# Altium project KC_Buffer.PrjPcb
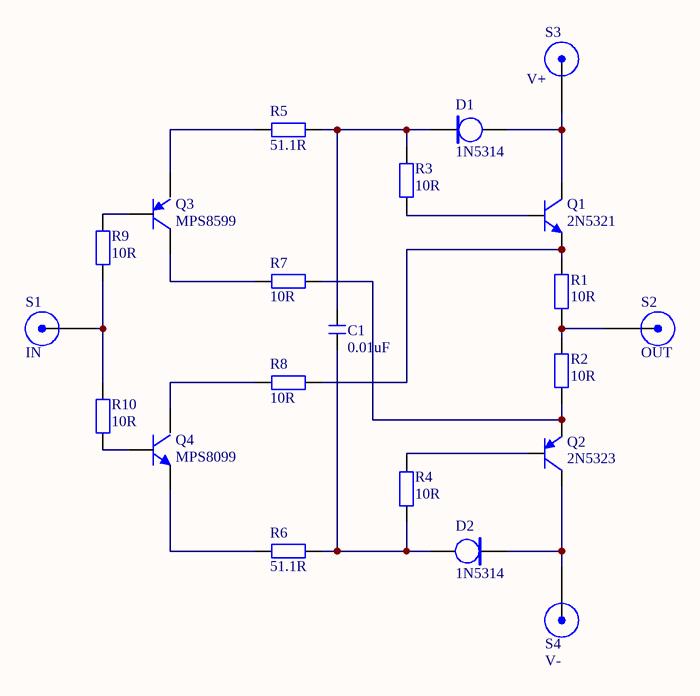
[diagram p0: KC_Buffer_Schematic.SchDoc]
1 sheet, 21 parts. Net scope: global (net labels, ports and power ports of the same name join across sheets).
Board file: KC_Buffer_PCB.PcbDoc

## Sheet KC_Buffer_Schematic.SchDoc
size A4

### Parts
C1  0.01uF  [CBB 6.3*6.3*5]
D1  1N5314  [DO-41G]
D2  1N5314  [DO-41G]
Q1  2N5321  [TO39_SMALLHOLE]
Q2  2N5323  [TO39_SMALLHOLE]
Q3  MPS8599  [TO92A_SmallHole]
Q4  MPS8099  [TO92A_SmallHole]
R1  10R  [RS 2W]
R2  10R  [RS 2W]
R3  10R  [RS 1/4W]
R4  10R  [RS 1/4W]
R5  51.1R  [RS 1/4W]
R6  51.1R  [RS 1/4W]
R7  10R  [RS 1/4W]
R8  10R  [RS 1/4W]
R9  10R  [RS 1/4W]
R10  10R  [RS 1/4W]
S1  IN  [Screw-M4-Small]
S2  OUT  [Screw-M4-Small]
S3  V+  [Screw-M4-Small]
S4  V-  [Screw-M4-Small]

### Nets
NetC1_1: C1.1 D2.2(Anode) R4.1 R6.1
NetC1_2: C1.2 D1.1(Cathode) R3.2 R5.1
NetD1_2: D1.2(Anode) Q1.2(C) S3.1(X)
NetD2_1: D2.1(Cathode) Q2.2(C) S4.1(X)
NetQ1_1: Q1.1(E) R1.2 R8.2
NetQ1_3: Q1.3(B) R3.1
NetQ2_1: Q2.1(E) R2.1 R7.2
NetQ2_3: Q2.3(B) R4.2
NetQ3_1: Q3.1(B) R9.2
NetQ3_2: Q3.2(C) R7.1
NetQ3_3: Q3.3(E) R5.2
NetQ4_1: Q4.1(B) R10.1
NetQ4_2: Q4.2(C) R8.1
NetQ4_3: Q4.3(E) R6.2
NetR1_1: R1.1 R2.2 S2.1(X)
NetR9_1: R9.1 R10.2 S1.1(X)

### Library data of the parts
C1 = C-CBB: CBB电容; 版权归属: 源创客; BOM名称: CBB电容; 学习资源: www.ooocke.com
D1 D2 = 1N5xxx: Current Regulator Diodes; pin to pad: 1>2 2>1
Q1 = 2N5320/5321: 中功率放大-NPN型 100V/1.2a; pin to pad: 2>3 3>2
Q2 = 2N5322/5323: 中功率放大-PNP型 100V/1.2a; pin to pad: 2>3 3>2
Q3 = MPS8598/8599: 音频放大-PNP型; pin to pad: 1>2 2>3 3>1
Q4 = MPS8098/8099: 音频放大-NPN型; pin to pad: 1>2 2>3 3>1
R1-R10 = R-CRR: 直插色环电阻; BOM名称: 色环电阻; 版权归属: 源创客; 学习资源: www.ooocke.com
S1-S4 = ScrewConnector: Screw Connector